# Altium schematic sheet OpenMV.SchDoc
size A3; Organization: Altium Limited; Address1: L3, 12a Rodborough Rd; Address2: Frenchs Forest; Address3: NSW; Address4: Australia 2086
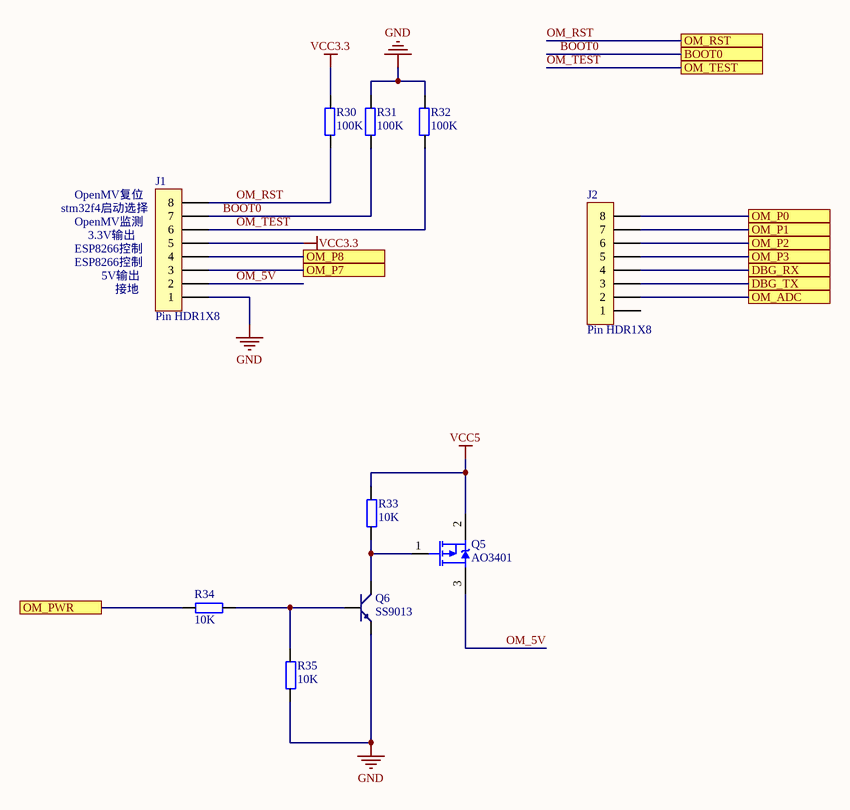
[diagram p0: OpenMV.SchDoc]

## Parts
J1  Pin HDR1X8  [Pin HDR1X8/2.54mm-S]
J2  Pin HDR1X8  [Pin HDR1X8/2.54mm-S]
Q5  AO3401  [SOT23-3M]
Q6  SS9013  [SOT-23R]
R30  100K  [0603P]
R31  100K  [0603P]
R32  100K  [0603P]
R33  10K  [0603P]
R34  10K  [0603P]
R35  10K  [0603P]

## Ports
BOOT0, DBG_RX, DBG_TX, OM_ADC, OM_P0, OM_P1, OM_P2, OM_P3, OM_P7, OM_P8, OM_PWR, OM_RST, OM_TEST

## Nets
GND: J1.1 Q6.1(E) R31.1 R32.1 R35.1
VCC3.3: J1.5 R30.1
VCC5: Q5.2(S) R33.2
BOOT0: J1.7 R31.2 ; port BOOT0
DBG_RX: J2.4 ; port DBG_RX
DBG_TX: J2.3 ; port DBG_TX
OM_5V: J1.2 Q5.3(D)
OM_ADC: J2.2 ; port OM_ADC
OM_P0: J2.8 ; port OM_P0
OM_P1: J2.7 ; port OM_P1
OM_P2: J2.6 ; port OM_P2
OM_P3: J2.5 ; port OM_P3
OM_P7: J1.3 ; port OM_P7
OM_P8: J1.4 ; port OM_P8
OM_PWR: R34.1 ; port OM_PWR
OM_RST: J1.8 R30.2 ; port OM_RST
OM_TEST: J1.6 R32.2 ; port OM_TEST
NetQ5_1: Q5.1(G) Q6.3(C) R33.1
NetQ6_2: Q6.2(B) R34.2 R35.2

Not connected (* = marked no-connect by the designer): J2 1

## Notes on the sheet
- OpenMV复位
- stm32f4启动选择
- OpenMV监测
- (near J1) ESP8266控制
- 3.3V输出
- 5V输出
- 接地
- Title
- Size:
- Date:
- A3
- Number:
- Time:
- Revision:
- Sheet
- of
- File:

## Library data of the parts
Q5 = MOSFET-P: MOS管_P沟道; PackageDocument: 1995/1996; Published: 8-Jun-2000; LatestRevisionDate: 17-Jul-2002; LatestRevisionNote: Re-released for DXP Platform.; PackageReference: E3; Publisher: Altium Limited
Q6 = NPN: 8050/BCW846/BCW847
R30-R35 = R